# Altium schematic sheet 3_Codec.SchDoc
size A4; SheetNumber: 3; SheetTotal: 4
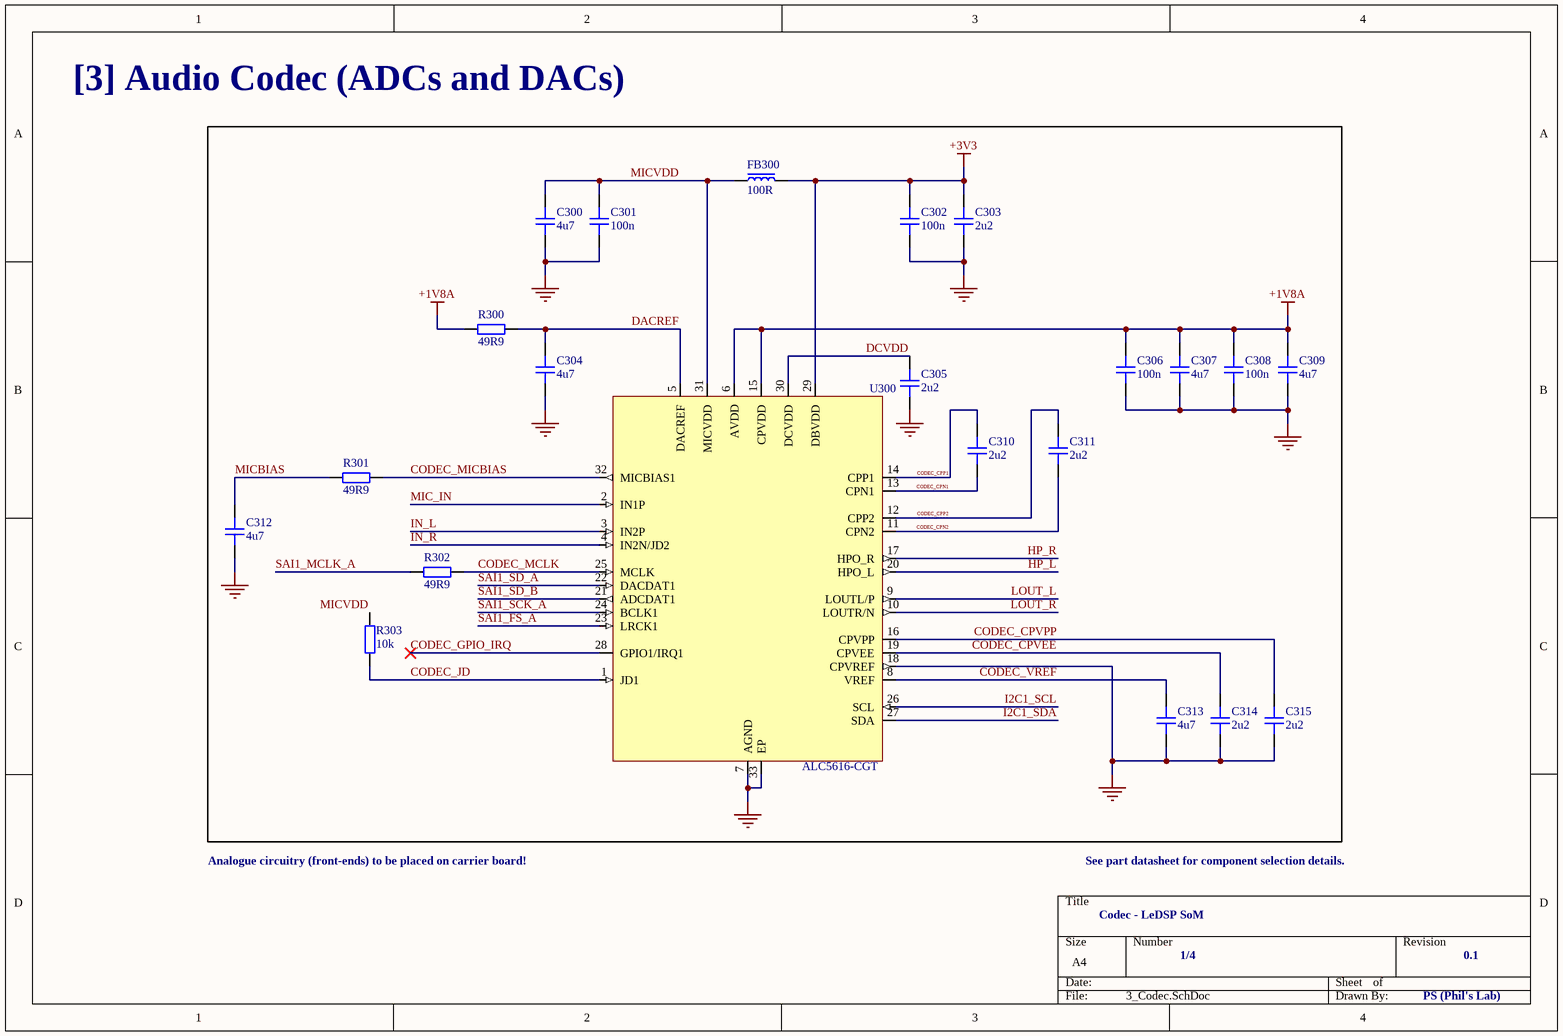
[diagram p0: 3_Codec.SchDoc]

## Parts
C300  4u7  [CAP_0402]
C301  100n  [CAP_0402]
C302  100n  [CAP_0402]
C303  2u2  [CAP_0402]
C304  4u7  [CAP_0402]
C305  2u2  [CAP_0402]
C306  100n  [CAP_0402]
C307  4u7  [CAP_0402]
C308  100n  [CAP_0402]
C309  4u7  [CAP_0402]
C310  2u2  [CAP_0402]
C311  2u2  [CAP_0402]
C312  4u7  [CAP_0402]
C313  4u7  [CAP_0402]
C314  2u2  [CAP_0402]
C315  2u2  [CAP_0402]
FB300  100R  [FB_0603]
R300  49R9  [RES_0402]
R301  49R9  [RES_0402]
R302  49R9  [RES_0402]
R303  10k  [RES_0402]
U300  ALC5616-CGT  [QFN-32-4x4]

## Nets
+1V8A: C306.2 C307.2 C308.2 C309.2 R300.1 U300.6(AVDD) U300.15(CPVDD)
+3V3: C302.2 C303.2 FB300.2 U300.29(DBVDD)
GND: C300.1 C301.1 C302.1 C303.1 C304.1 C305.1 C306.1 C307.1 C308.1 C309.1 C312.1 C313.1 C314.1 C315.1 U300.7(AGND) U300.18(CPVREF) U300.33(EP)
CODEC_CPN1: C310.1 U300.13(CPN1)
CODEC_CPN2: C311.1 U300.11(CPN2)
CODEC_CPP1: C310.2 U300.14(CPP1)
CODEC_CPP2: C311.2 U300.12(CPP2)
CODEC_CPVEE: C314.2 U300.19(CPVEE)
CODEC_CPVPP: C315.2 U300.16(CPVPP)
CODEC_GPIO_IRQ: U300.28(GPIO1/IRQ1)
CODEC_JD: R303.1 U300.1(JD1)
CODEC_MCLK: R302.2 U300.25(MCLK)
CODEC_MICBIAS: R301.2 U300.32(MICBIAS1)
CODEC_VREF: C313.2 U300.8(VREF)
DACREF: C304.2 R300.2 U300.5(DACREF)
DCVDD: C305.2 U300.30(DCVDD)
HP_L: U300.20(HPO_L)
HP_R: U300.17(HPO_R)
I2C1_SCL: U300.26(SCL)
I2C1_SDA: U300.27(SDA)
IN_L: U300.3(IN2P)
IN_R: U300.4(IN2N/JD2)
LOUT_L: U300.9(LOUTL/P)
LOUT_R: U300.10(LOUTR/N)
MIC_IN: U300.2(IN1P)
MICBIAS: C312.2 R301.1
MICVDD: C300.2 C301.2 FB300.1 R303.2 U300.31(MICVDD)
SAI1_FS_A: U300.23(LRCK1)
SAI1_MCLK_A: R302.1
SAI1_SCK_A: U300.24(BCLK1)
SAI1_SD_A: U300.22(DACDAT1)
SAI1_SD_B: U300.21(ADCDAT1)

## Notes on the sheet
- [3] Audio Codec (ADCs and DACs)
- Analogue circuitry (front-ends) to be placed on carrier board!
- See part datasheet for component selection details.
- Codec - LeDSP SoM
- 1/4
- 0.1
- PS (Phil's Lab)

## Library data of the parts
C300-C315 = CAP_0402_16V: Capacitor SMD 0402 16V
FB300 = FB_0603: Ferrite Bead SMD 0603
R300-R303 = RES_0402: Resistor SMD 0402
U300 = ALC5616-CGT: Ultra-Low Power Audio CODEC; Manufacturer: Realtek; Manufacturer Part Number: ALC5616-CGT